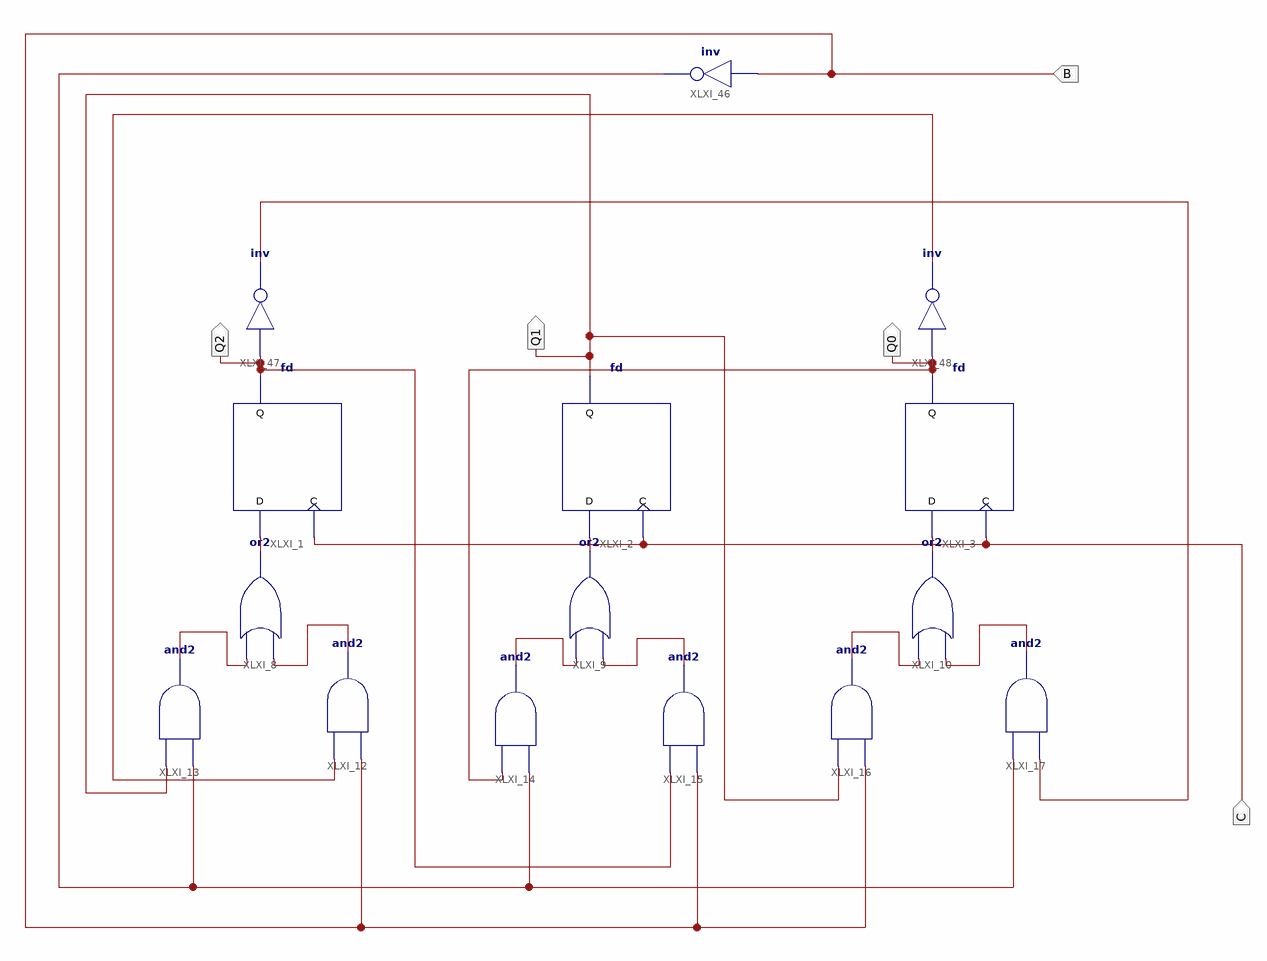
[diagram p0: schematic sheet 1]
// Xilinx ISE schematic bit_3_counter.sch (spartan3e) as structural Verilog: 15 symbols, 5 ports
module bit_3_counter (
  input  B,
  input  C,
  output Q1,
  output Q0,
  output Q2
);

  wire XLXN_6, XLXN_7, XLXN_8, XLXN_13, XLXN_14, XLXN_16, XLXN_17, XLXN_18, XLXN_19, XLXN_51, XLXN_56,
       XLXN_62;

  fd XLXI_3 (.C(C), .D(XLXN_8), .Q(Q0));
  or XLXI_10 (XLXN_8, XLXN_19, XLXN_18);
  and XLXI_16 (XLXN_18, B, Q1);
  and XLXI_17 (XLXN_19, XLXN_62, XLXN_51);
  and XLXI_15 (XLXN_17, B, Q2);
  and XLXI_14 (XLXN_16, XLXN_51, Q0);
  or XLXI_9 (XLXN_7, XLXN_17, XLXN_16);
  fd XLXI_2 (.C(C), .D(XLXN_7), .Q(Q1));
  fd XLXI_1 (.C(C), .D(XLXN_6), .Q(Q2));
  or XLXI_8 (XLXN_6, XLXN_14, XLXN_13);
  and XLXI_13 (XLXN_13, XLXN_51, Q1);
  and XLXI_12 (XLXN_14, B, XLXN_56);
  not XLXI_46 (XLXN_51, B);
  not XLXI_47 (XLXN_62, Q2);
  not XLXI_48 (XLXN_56, Q0);
endmodule
